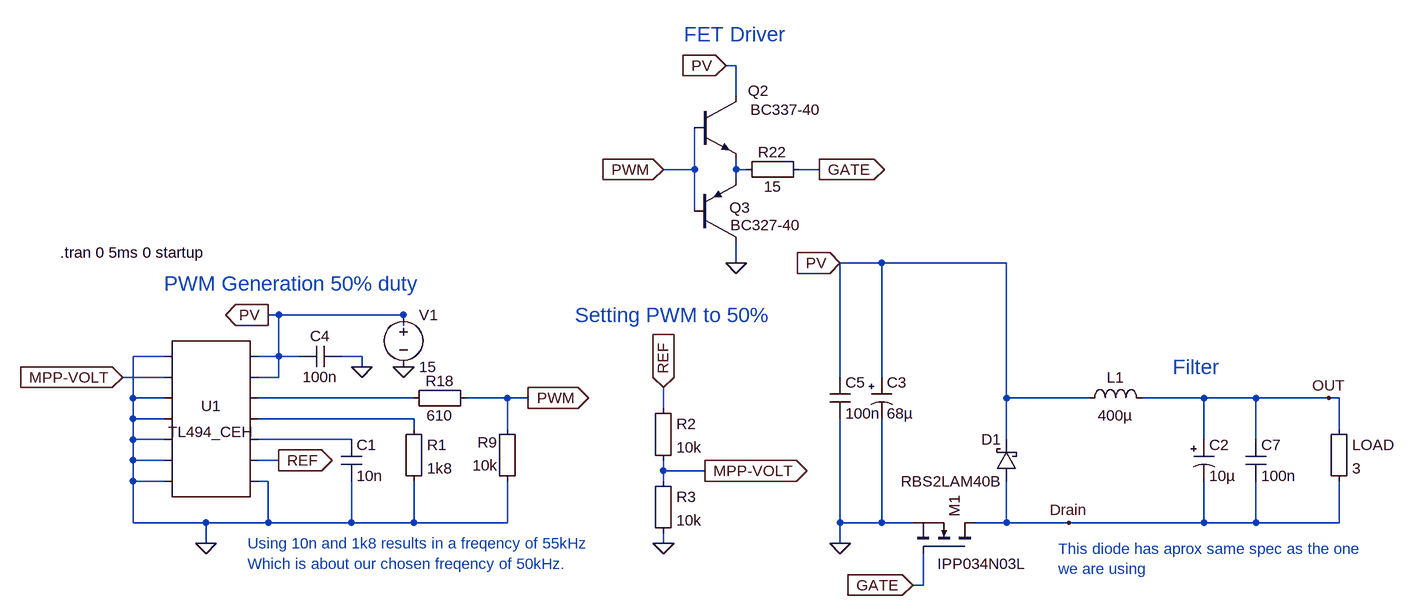
[diagram p0: schematic Solar-Car-Buck.asc]
Solar-Car-Buck.asc, the LTspice schematic file:
Version 4
SHEET 1 1952 828
WIRE -224 -752 -240 -752
WIRE -224 -704 -224 -752
WIRE -288 -592 -288 -656
WIRE -288 -592 -336 -592
WIRE -224 -592 -224 -608
WIRE -208 -592 -224 -592
WIRE -96 -592 -128 -592
WIRE -224 -576 -224 -592
WIRE -288 -528 -288 -592
WIRE -224 -448 -224 -480
WIRE 0 -448 -64 -448
WIRE 192 -448 0 -448
WIRE -928 -368 -944 -368
WIRE -736 -368 -928 -368
WIRE -736 -352 -736 -368
WIRE -1104 -304 -1152 -304
WIRE -928 -304 -928 -368
WIRE -928 -304 -960 -304
WIRE -896 -304 -928 -304
WIRE -800 -304 -832 -304
WIRE -800 -288 -800 -304
WIRE -1104 -272 -1168 -272
WIRE -928 -272 -928 -304
WIRE -928 -272 -960 -272
WIRE -64 -272 -64 -448
WIRE 0 -272 0 -448
WIRE -1152 -240 -1152 -304
WIRE -1104 -240 -1152 -240
WIRE -720 -240 -960 -240
WIRE -576 -240 -640 -240
WIRE -544 -240 -576 -240
WIRE 192 -240 192 -448
WIRE 320 -240 192 -240
WIRE 496 -240 400 -240
WIRE 576 -240 496 -240
WIRE 688 -240 576 -240
WIRE 704 -240 688 -240
WIRE -336 -224 -336 -256
WIRE -1152 -208 -1152 -240
WIRE -1104 -208 -1152 -208
WIRE -720 -208 -960 -208
WIRE -720 -192 -720 -208
WIRE -576 -192 -576 -240
WIRE 704 -192 704 -240
WIRE -1152 -176 -1152 -208
WIRE -1104 -176 -1152 -176
WIRE -816 -176 -960 -176
WIRE 192 -176 192 -240
WIRE 496 -176 496 -240
WIRE 576 -176 576 -240
WIRE -1152 -144 -1152 -176
WIRE -1104 -144 -1152 -144
WIRE -928 -144 -960 -144
WIRE -336 -128 -336 -144
WIRE -272 -128 -336 -128
WIRE -1152 -112 -1152 -144
WIRE -1104 -112 -1152 -112
WIRE -944 -112 -960 -112
WIRE -336 -112 -336 -128
WIRE -1152 -48 -1152 -112
WIRE -1040 -48 -1152 -48
WIRE -944 -48 -944 -112
WIRE -944 -48 -1040 -48
WIRE -816 -48 -816 -112
WIRE -816 -48 -944 -48
WIRE -720 -48 -720 -112
WIRE -720 -48 -816 -48
WIRE -576 -48 -576 -112
WIRE -576 -48 -720 -48
WIRE -64 -48 -64 -208
WIRE 0 -48 0 -208
WIRE 0 -48 -64 -48
WIRE 48 -48 0 -48
WIRE 192 -48 192 -112
WIRE 192 -48 144 -48
WIRE 288 -48 192 -48
WIRE 496 -48 496 -112
WIRE 496 -48 288 -48
WIRE 576 -48 576 -112
WIRE 576 -48 496 -48
WIRE 704 -48 704 -112
WIRE 704 -48 576 -48
WIRE -1040 -16 -1040 -48
WIRE -336 -16 -336 -32
WIRE -64 -16 -64 -48
WIRE 64 48 64 0
WIRE 64 48 48 48
FLAG -336 -16 0
FLAG -928 -144 REF
IOPIN -928 -144 Out
FLAG -336 -256 REF
IOPIN -336 -256 In
FLAG -64 -16 0
FLAG -272 -128 MPP-VOLT
IOPIN -272 -128 Out
FLAG -1168 -272 MPP-VOLT
IOPIN -1168 -272 In
FLAG -64 -448 PV
IOPIN -64 -448 In
FLAG 48 48 GATE
IOPIN 48 48 In
FLAG -944 -368 PV
IOPIN -944 -368 Out
FLAG -800 -288 0
FLAG -544 -240 PWM
IOPIN -544 -240 Out
FLAG -224 -448 0
FLAG -240 -752 PV
IOPIN -240 -752 In
FLAG -96 -592 GATE
IOPIN -96 -592 Out
FLAG -1040 -16 0
FLAG -336 -592 PWM
IOPIN -336 -592 In
FLAG 688 -240 OUT
FLAG -736 -288 0
FLAG 288 -48 Drain
SYMBOL Misc\\EuropeanResistor -736 -208 R0
SYMATTR InstName R1
SYMATTR Value 1k8
SYMBOL Misc\\EuropeanCap -832 -176 R0
SYMATTR InstName C1
SYMATTR Value 10n
SYMBOL Misc\\EuropeanResistor -352 -240 R0
SYMATTR InstName R2
SYMATTR Value 10k
SYMBOL Misc\\EuropeanResistor -352 -128 R0
SYMATTR InstName R3
SYMATTR Value 10k
SYMBOL ind 304 -224 R270
WINDOW 0 32 56 VTop 2
WINDOW 3 5 56 VBottom 2
SYMATTR InstName L1
SYMATTR Value 400µ
SYMBOL Misc\\EuropeanPolcap 480 -176 R0
SYMATTR InstName C2
SYMATTR Value 10µ
SYMBOL Misc\\EuropeanPolcap -16 -272 R0
SYMATTR InstName C3
SYMATTR Value 68µ
SYMBOL Misc\\EuropeanResistor -560 -96 R180
WINDOW 0 31 76 Left 2
WINDOW 3 31 40 Left 2
SYMATTR InstName R9
SYMATTR Value 10k
SYMBOL Misc\\EuropeanCap -832 -320 R90
WINDOW 0 0 32 VBottom 2
WINDOW 3 32 32 VTop 2
SYMATTR InstName C4
SYMATTR Value 100n
SYMBOL Misc\\EuropeanCap -80 -272 R0
SYMATTR InstName C5
SYMATTR Value 100n
SYMBOL Misc\\EuropeanResistor -624 -256 R90
WINDOW 0 5 56 VBottom 2
WINDOW 3 27 56 VTop 2
SYMATTR InstName R18
SYMATTR Value 610
SYMBOL npn -288 -704 R0
WINDOW 0 82 -9 Left 2
WINDOW 3 86 20 Left 2
SYMATTR InstName Q2
SYMATTR Value BC337-40
SYMBOL pnp -288 -480 M180
WINDOW 0 54 53 Left 2
WINDOW 3 55 26 Left 2
SYMATTR InstName Q3
SYMATTR Value BC327-40
SYMBOL Misc\\EuropeanResistor -112 -608 R90
WINDOW 0 5 56 VBottom 2
WINDOW 3 27 56 VTop 2
SYMATTR InstName R22
SYMATTR Value 15
SYMBOL AutoGenerated\\TL494_CEH -1040 -208 R0
SYMATTR InstName U1
SYMBOL nmos 144 0 M270
WINDOW 3 -15 58 VLeft 2
SYMATTR Value IPP034N03L
SYMATTR InstName M1
SYMBOL schottky 208 -112 R180
WINDOW 0 24 64 Left 2
WINDOW 3 24 0 Left 2
SYMATTR InstName D1
SYMATTR Value RBS2LAM40B
SYMBOL Misc\\EuropeanCap 560 -176 R0
SYMATTR InstName C7
SYMATTR Value 100n
SYMBOL Misc\\EuropeanResistor 688 -208 R0
SYMATTR InstName LOAD
SYMATTR Value 3
SYMBOL voltage -736 -384 R0
WINDOW 123 0 0 Left 2
WINDOW 39 0 0 Left 2
SYMATTR InstName V1
SYMATTR Value 15
TEXT -1264 -464 Left 2 !.tran 0 5ms 0 startup
TEXT -976 -16 Left 2 ;Using 10n and 1k8 results in a freqency of 55kHz \nWhich is about our chosen freqency of 50kHz.
TEXT 272 -8 Left 2 ;This diode has aprox same spec as the one \nwe are using
TEXT -304 -800 Left 3 ;FET Driver
TEXT -1104 -416 Left 3 ;PWM Generation 50% duty
TEXT -472 -368 Left 3 ;Setting PWM to 50%
TEXT 448 -288 Left 3 ;Filter

The netlist it stands for:
* Solar-Car-Buck.asc
R1 N003 0 1k8
C1 N004 0 10n
R2 REF MPP-VOLT 10k
R3 MPP-VOLT 0 10k
L1 PV OUT 400µ
C2 OUT Drain 10µ
C3 PV 0 68µ
R9 0 PWM 10k
C4 0 PV 100n
C5 PV 0 100n
R18 PWM N002 610
Q2 PV PWM N001 0 BC337-40
Q3 0 PWM N001 0 BC327-40
R22 GATE N001 15
* U1: TL494_CEH (symbol AutoGenerated\TL494_CEH not available, pins judged from their places): pin1=0 pin2=MPP-VOLT pin3=0 pin4=0 pin5=0 pin6=0 pin7=0 pin8=PV pin9=PV pin10=N002 pin11=N003 pin12=N004 pin13=REF pin14=0
M1 Drain GATE 0 0 IPP034N03L
D1 Drain PV RBS2LAM40B
C7 OUT Drain 100n
R§LOAD OUT Drain 3
V1 PV 0 15
.model D D
.lib standard.dio
.model NPN NPN
.model PNP PNP
.lib standard.bjt
.model NMOS NMOS
.model PMOS PMOS
.lib standard.mos
.tran 0 5ms 0 startup
* Using 10n and 1k8 results in a freqency of 55kHz
* Which is about our chosen freqency of 50kHz.
* This diode has aprox same spec as the one
* we are using
* FET Driver
* PWM Generation 50% duty
* Setting PWM to 50%
* Filter
.backanno
.end